# EAGLE schematic ProcessorTestBoardV2 (EAGLE 7.6.0)
Small breakout board to test basic funtionality of processor. Contains programming connectors, I2C IR sensors, 3V3 and 3V6 voltage regulators, a bus switch, and the MRAM.
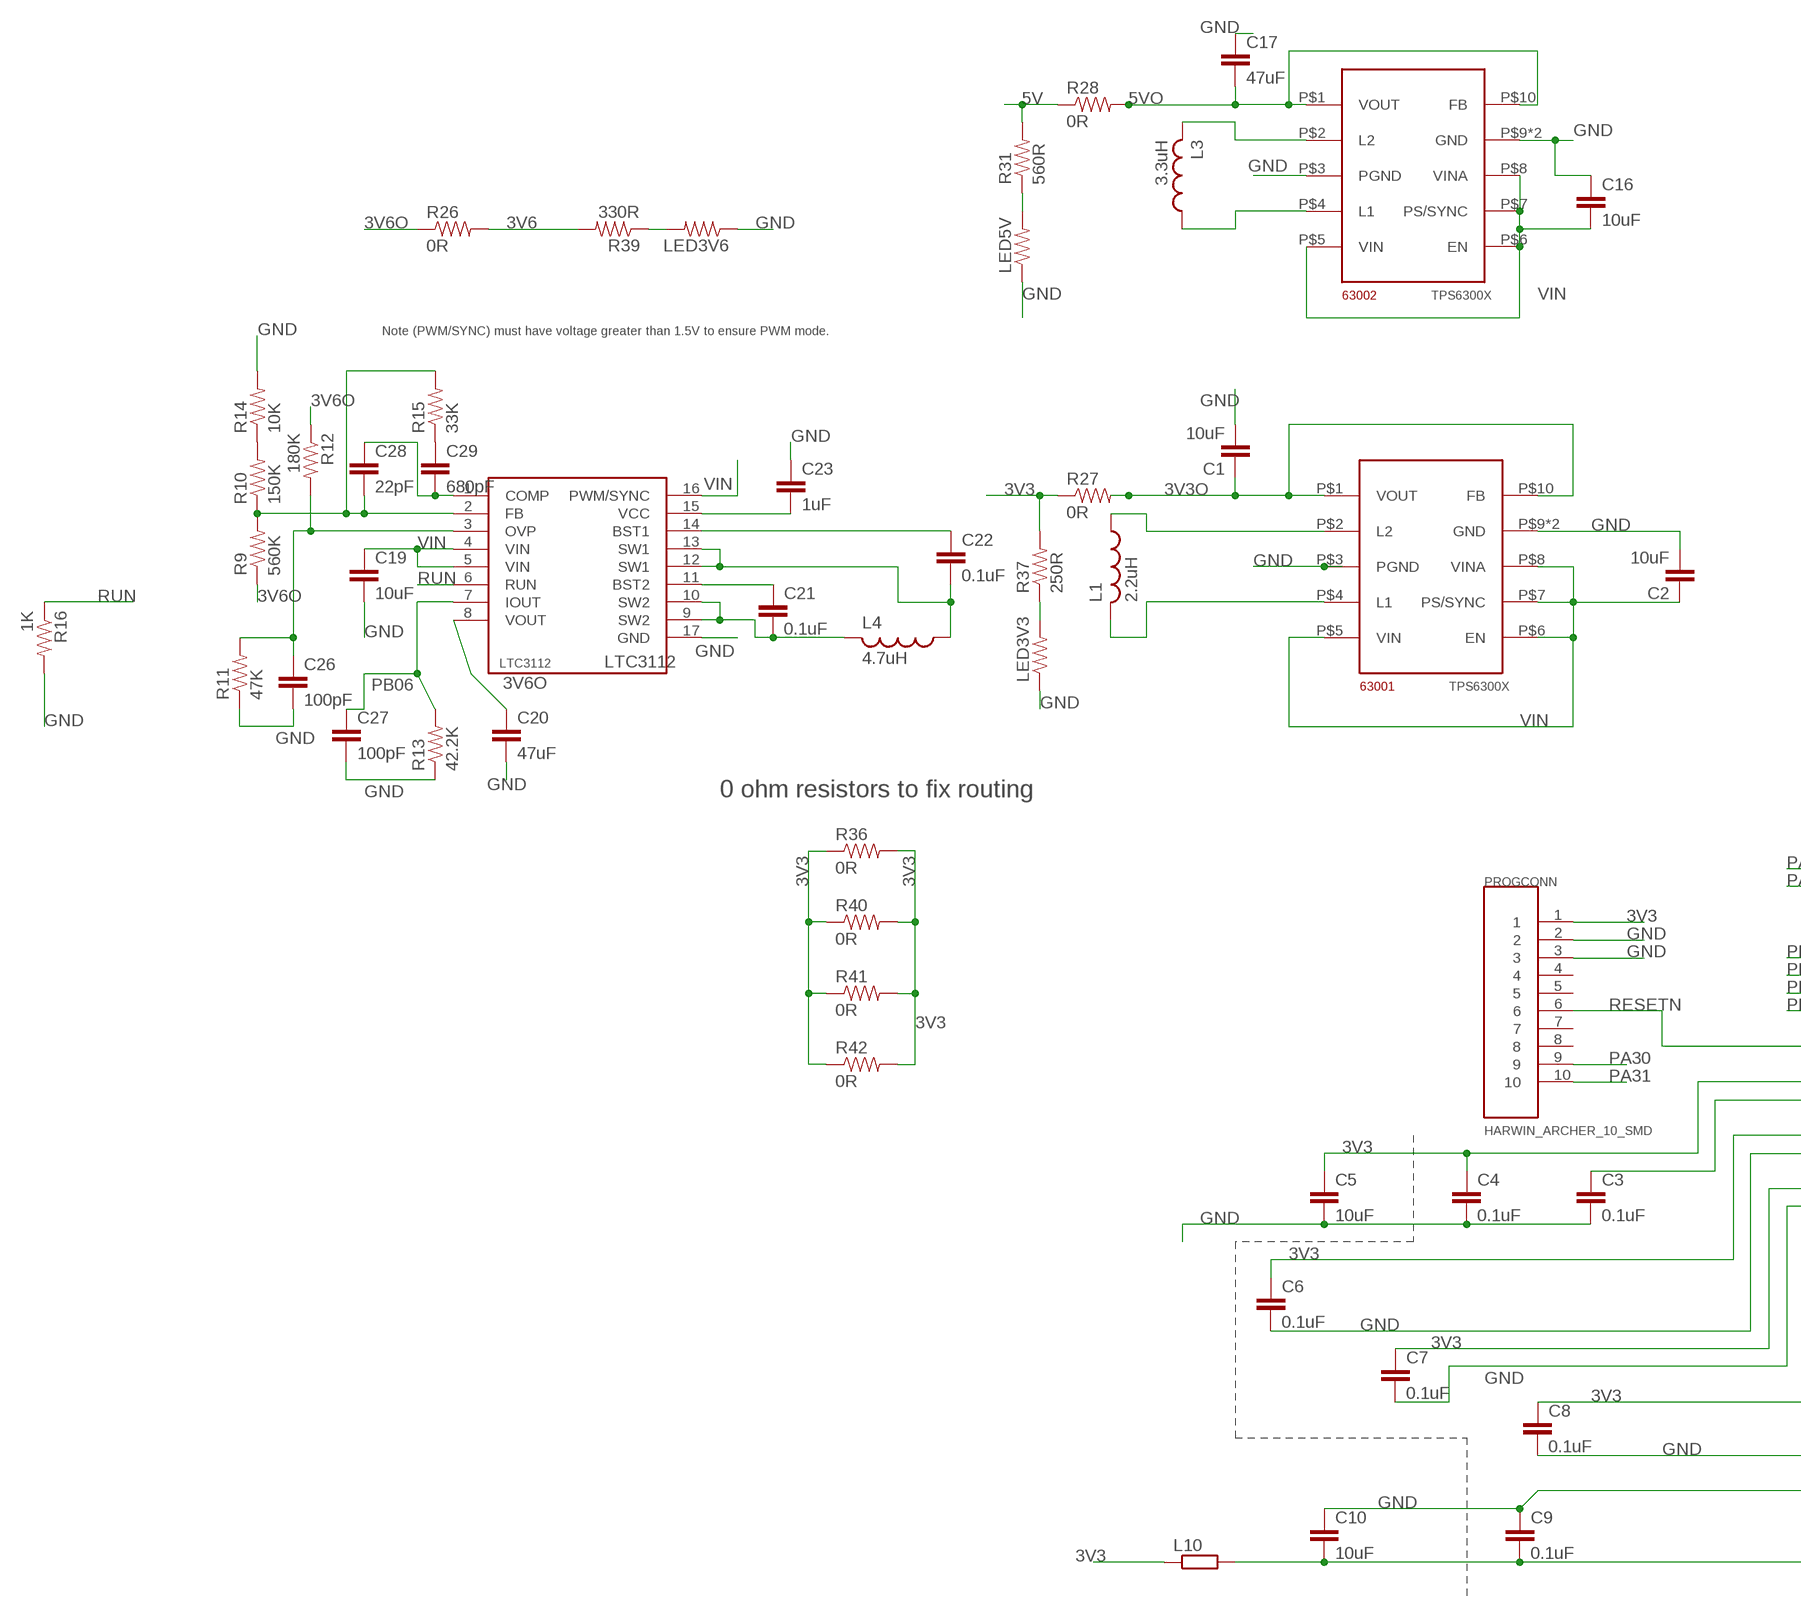
[diagram p0: schematic, sheet 1, part 1 of 2]
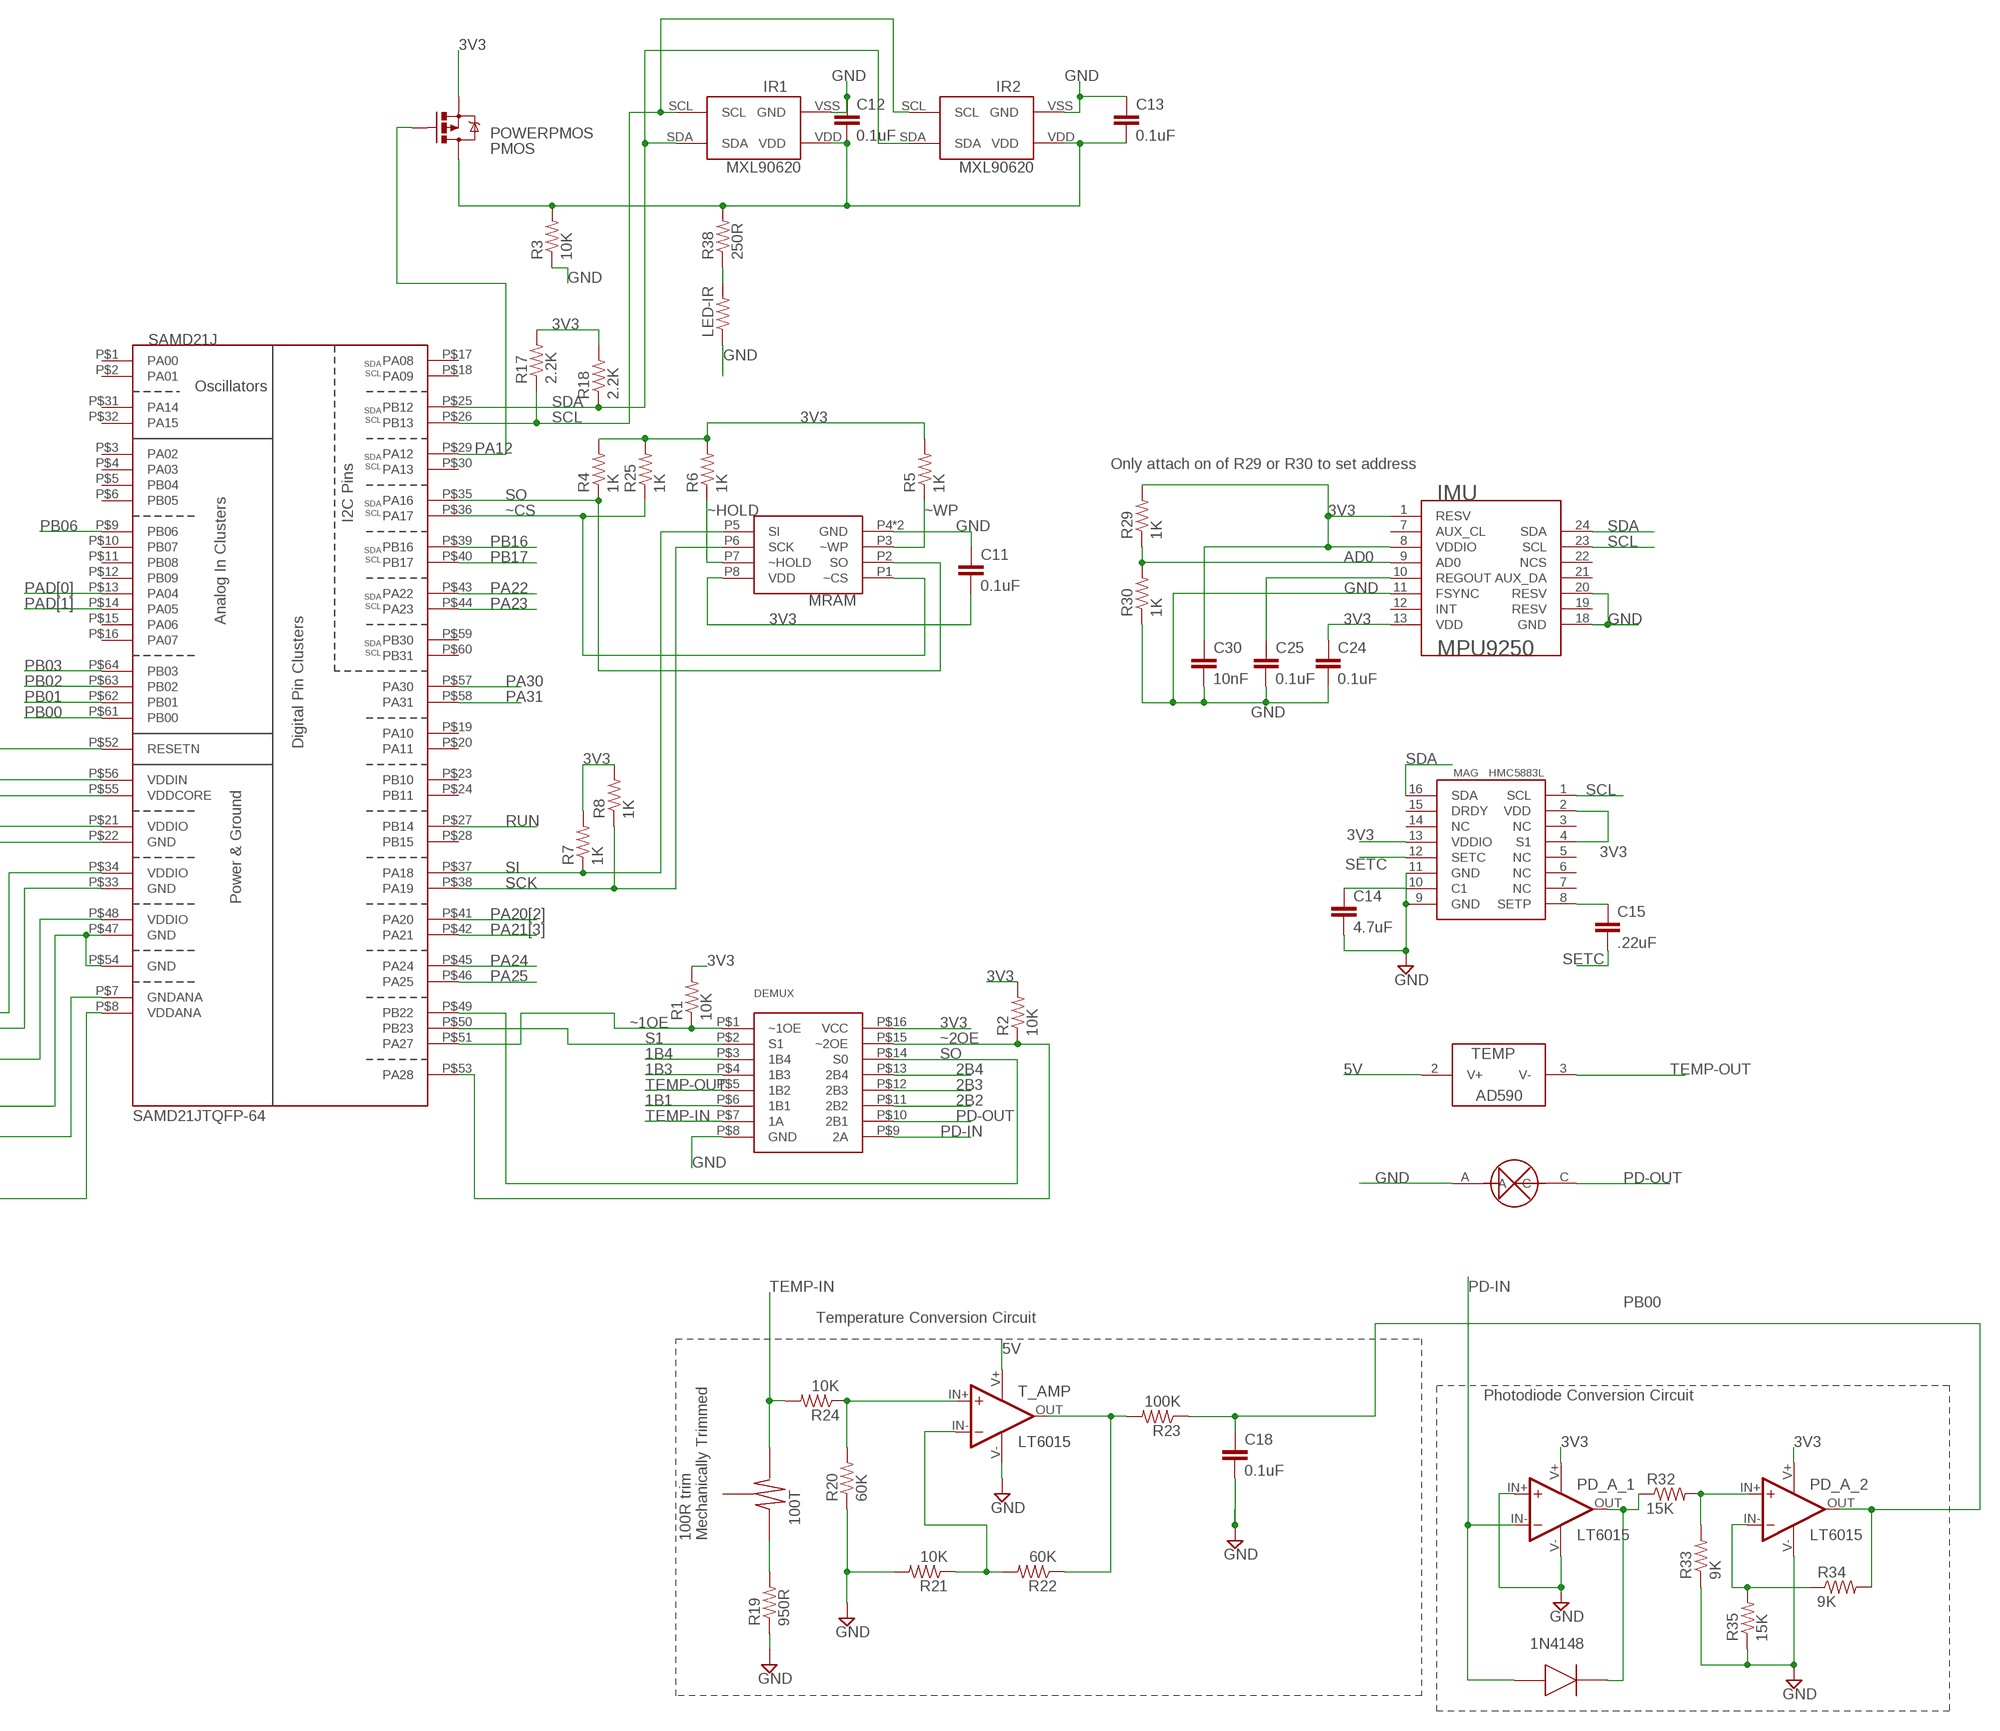
[diagram p1: schematic, sheet 1, part 2 of 2]

## Parts
1N4148  1N4148WS  [SOD-323F]
100T  TRIMPOT-TC33  [TC33X-2]
63001  TPS6300X  [QFN10_POWERPAD]
63002  TPS6300X  [QFN10_POWERPAD]
C1  10uF  CAP0805  [0805]
C2  10uF  CAP0805  [0805]
C3  0.1uF  CAP0805  [0805]
C4  0.1uF  CAP0805  [0805]
C5  10uF  CAP0805  [0805]
C6  0.1uF  CAP0805  [0805]
C7  0.1uF  CAP0805  [0805]
C8  0.1uF  CAP0805  [0805]
C9  0.1uF  CAP0805  [0805]
C10  10uF  CAP0805  [0805]
C11  0.1uF  CAP0805  [0805]
C12  0.1uF  CAP0805  [0805]
C13  0.1uF  CAP0805  [0805]
C14  4.7uF  CAP0805  [0805]
C15  .22uF  CAP0805  [0805]
C16  10uF  CAP0603-CAP  [0603-CAP]
C17  47uF  CAP0603-CAP  [0603-CAP]
C18  0.1uF  CAP0805  [0805]
C19  10uF  CAP0603-CAP  [0603-CAP]
C20  47uF  CAP0805  [0805]
C21  0.1uF  CAP0603-CAP  [0603-CAP]
C22  0.1uF  CAP0603-CAP  [0603-CAP]
C23  1uF  CAP0603-CAP  [0603-CAP]
C24  0.1uF  CAP0805  [0805]
C25  0.1uF  CAP0805  [0805]
C26  100pF  CAP0805  [0805]
C27  100pF  CAP0805  [0805]
C28  22pF  CAP0805  [0805]
C29  680pF  CAP0805  [0805]
C30  10nF  CAP0805  [0805]
DEMUX  SN74CBTLV3253  [SOIC16R]
IMU  MPU9250  [QFN-24-3X3]
IR1  MXL90620  [MXL90620]
IR2  MXL90620  [MXL90620]
L1  2.2uH  L-USL3225M  [L3225M]
L3  3.3uH  L-USL3225M  [L3225M]
L4  4.7uH  L-USL3225M  [L3225M]
L10  R-EU_R0805  [R0805]
LED3V3  RESISTOR  [0805]
LED3V6  RESISTOR  [0805]
LED5V  RESISTOR  [0805]
LED-IR  RESISTOR  [0805]
LTC3112  LTC3112  [DHD16]
MAG  HMC5883L  [HMC5883L]
MRAM  MR25H10CDC  [8PXMO-229]
PD  PHOTODETECTOR  [PHOTODECTORDEVICE2]
PD_A_1  LT6015  [SOT23-5]
PD_A_2  LT6015  [SOT23-5]
PMOS  POWERPMOS  [SO08]
PROGCONN  HARWIN_ARCHER_10_SMD  [HARWIN_ARCHER_10_SMD]
R1  10K  RESISTOR  [0805]
R2  10K  RESISTOR  [0805]
R3  10K  RESISTOR  [0805]
R4  1K  RESISTOR  [0805]
R5  1K  RESISTOR  [0805]
R6  1K  RESISTOR  [0805]
R7  1K  RESISTOR  [0805]
R8  1K  RESISTOR  [0805]
R9  560K  RESISTOR  [0805]
R10  150K  RESISTOR  [0805]
R11  47K  RESISTOR  [0805]
R12  180K  RESISTOR  [0805]
R13  42.2K  RESISTOR  [0805]
R14  10K  RESISTOR  [0805]
R15  33K  RESISTOR  [0805]
R16  1K  RESISTOR  [0805]
R17  2.2K  RESISTOR  [0805]
R18  2.2K  RESISTOR  [0805]
R19  950R  RESISTOR  [0805]
R20  60K  RESISTOR  [0805]
R21  10K  RESISTOR  [0805]
R22  60K  RESISTOR  [0805]
R23  100K  RESISTOR  [0805]
R24  10K  RESISTOR  [0805]
R25  1K  RESISTOR  [0805]
R26  0R  RESISTOR  [0805]
R27  0R  RESISTOR  [0805]
R28  0R  RESISTOR  [0805]
R29  1K  RESISTOR  [0805]
R30  1K  RESISTOR  [0805]
R31  560R  RESISTOR  [0805]
R32  15K  RESISTOR  [0805]
R33  9K  RESISTOR  [0805]
R34  9K  RESISTOR  [0805]
R35  15K  RESISTOR  [0805]
R36  0R  RESISTOR  [0805]
R37  250R  RESISTOR  [0805]
R38  250R  RESISTOR  [0805]
R39  330R  RESISTOR  [0805]
R40  0R  RESISTOR  [0805]
R41  0R  RESISTOR  [0805]
R42  0R  RESISTOR  [0805]
SAMD21J  SAMD21JTQFP-64  [TQFP-64]
T_AMP  LT6015  [SOT23-5]
TEMP  AD590  AD590-SOIC-8  [8SOIC]

## Nets
1B1: DEMUX.P$6(1B1)
1B3: DEMUX.P$4(1B3)
1B4: DEMUX.P$3(1B4)
2B2: DEMUX.P$11(2B2)
2B3: DEMUX.P$12(2B3)
2B4: DEMUX.P$13(2B4)
3V3: C4.1 C5.1 C6.1 C7.1 C8.1 C11.2 C24.1 C30.1 DEMUX.P$16(VCC) IMU.1(RESV) IMU.8(VDDIO) IMU.13(VDD) L10.1 MAG.2(VDD) MAG.4(S1) MAG.13(VDDIO) MRAM.P8(VDD) PD_A_1.V+ PD_A_2.V+ PMOS.1(S) PMOS.2(S) PMOS.3(S) PROGCONN.1 R1.2 R2.2 R4.2 R5.2 R6.2 R7.2 R8.2 R17.2 R18.2 R25.2 R27.1 R29.2 R36.1 R36.2 R37.2 R40.1 R40.2 R41.1 R41.2 R42.1 R42.2 SAMD21J.P$21(VDDIO) SAMD21J.P$34(VDDIO) SAMD21J.P$48(VDDIO) SAMD21J.P$56(VDDIN)
3V3O: 63001.P$1(VOUT) 63001.P$10(FB) C1.1 R27.2
3V6: R26.2 R39.2
3V6O [3V6]: C20.1 LTC3112.8(VOUT) R9.1 R12.1 R26.1
5V [5V]: R28.1 R31.2 T_AMP.V+ TEMP.2(V+)
5VO [5V]: 63002.P$1(VOUT) 63002.P$10(FB) C17.2 R28.2
AD0: IMU.9(AD0) R29.1 R30.2
GND: 63001.P$3(PGND) 63001.P$9(GND) 63001.PAD(GND) 63002.P$3(PGND) 63002.P$9(GND) 63002.PAD(GND) C1.2 C2.2 C3.2 C4.2 C5.2 C6.2 C7.2 C8.2 C9.1 C10.1 C11.1 C12.1 C13.1 C14.2 C16.1 C17.1 C18.2 C19.2 C20.2 C23.1 C24.2 C25.2 C26.2 C27.2 C30.2 DEMUX.P$8(GND) IMU.11(FSYNC) IMU.18(GND) IMU.20(RESV) IR1.VSS(GND) IR2.VSS(GND) LED3V3.1 LED3V6.1 LED5V.1 LED-IR.1 LTC3112.17(GND) MAG.9(GND) MAG.11(GND) MRAM.P4(GND) MRAM.P9(GND) PD.A PD_A_1.IN+ PD_A_1.V- PD_A_2.V- PROGCONN.2 PROGCONN.3 R3.1 R11.1 R13.1 R14.2 R16.2 R19.1 R20.1 R21.2 R30.1 R33.1 R35.1 SAMD21J.P$7(GNDANA) SAMD21J.P$22(GND) SAMD21J.P$33(GND) SAMD21J.P$47(GND) SAMD21J.P$54(GND) T_AMP.V-
N$1: C12.2 C13.2 IR1.VDD IR2.VDD PMOS.5(D) PMOS.6(D) PMOS.7(D) PMOS.8(D) R3.2 R38.2
N$2: 63001.P$4(L1) L1.2
N$3: 63001.P$2(L2) L1.1
N$4: C21.1 LTC3112.11(BST2)
N$5: C22.1 LTC3112.14(BST1)
N$6: C23.2 LTC3112.15(VCC)
N$7: C14.1 MAG.10(C1)
N$8: C3.1 SAMD21J.P$55(VDDCORE)
N$9 [GND]: R20.2 R24.1 T_AMP.IN+
N$10: R22.1 R23.2 T_AMP.OUT
N$11: R21.1 R22.2 T_AMP.IN-
N$12: 1N4148.CATHODE PD_A_1.OUT R32.1
N$13: 100T.P$1 R19.2
N$14: C25.1 IMU.10(REGOUT)
N$15: PD_A_2.IN+ R32.2 R33.2
N$16: LED-IR.2 R38.1
N$17: C9.2 C10.2 L10.2 SAMD21J.P$8(VDDANA)
N$19: PD_A_2.IN- R34.1 R35.2
N$21: LED3V6.2 R39.1
N$22: LED5V.2 R31.1
N$23: LED3V3.2 R37.1
N$36: C15.1 MAG.8(SETP)
N$40: C22.2 L4.1 LTC3112.12(SW1) LTC3112.13(SW1)
N$45: 63002.P$2(L2) L3.2
N$46: 63002.P$4(L1) L3.1
N$53: C21.2 L4.2 LTC3112.9(SW2) LTC3112.10(SW2)
N$54: C28.2 LTC3112.2(FB) R9.2 R10.1 R15.2
N$69: C26.1 LTC3112.3(OVP) R11.2 R12.2
N$70: C29.1 R15.1
N$71: C28.1 C29.2 LTC3112.1(COMP)
N$999: R10.2 R14.1
PA12: PMOS.4(G) SAMD21J.P$29(PA12)
PA20[2]: SAMD21J.P$41(PA20)
PA21[3]: SAMD21J.P$42(PA21)
PA22: SAMD21J.P$43(PA22)
PA23: SAMD21J.P$44(PA23)
PA24: SAMD21J.P$45(PA24)
PA25: SAMD21J.P$46(PA25)
PA30: PROGCONN.9 SAMD21J.P$57(PA30)
PA31: PROGCONN.10 SAMD21J.P$58(PA31)
PAD[0]: SAMD21J.P$13(PA04)
PAD[1]: SAMD21J.P$14(PA05)
PB00: C18.1 PD_A_2.OUT R23.1 R34.2 SAMD21J.P$61(PB00)
PB01: SAMD21J.P$62(PB01)
PB02: SAMD21J.P$63(PB02)
PB03: SAMD21J.P$64(PB03)
PB06: C27.1 LTC3112.7(IOUT) R13.2 SAMD21J.P$9(PB06)
PB16: SAMD21J.P$39(PB16)
PB17: SAMD21J.P$40(PB17)
PD-IN: 1N4148.ANODE DEMUX.P$9(2A) PD_A_1.IN-
PD-OUT: DEMUX.P$10(2B1) PD.C
RESETN: PROGCONN.6 SAMD21J.P$52(RESETN)
RUN: LTC3112.6(RUN) R16.1 SAMD21J.P$27(PB14)
S1: DEMUX.P$2(S1) SAMD21J.P$50(PB23)
SCK: MRAM.P6(SCK) R8.1 SAMD21J.P$38(PA19)
SCL: IMU.23(SCL) IR1.SCL IR2.SCL MAG.1(SCL) R17.1 SAMD21J.P$26(PB13)
SDA: IMU.24(SDA) IR1.SDA IR2.SDA MAG.16(SDA) R18.1 SAMD21J.P$25(PB12)
SETC: C15.2 MAG.12(SETC)
SI: MRAM.P5(SI) R7.1 SAMD21J.P$37(PA18)
SO: DEMUX.P$14(S0) MRAM.P2(SO) R4.1 SAMD21J.P$35(PA16) SAMD21J.P$49(PB22)
TEMP-IN: 100T.P$3 DEMUX.P$7(1A) R24.2
TEMP-OUT: DEMUX.P$5(1B2) TEMP.3(V-)
VIN: 63001.P$5(VIN) 63001.P$6(EN) 63001.P$7(PS/SYNC) 63001.P$8(VINA) 63002.P$5(VIN) 63002.P$6(EN) 63002.P$7(PS/SYNC) 63002.P$8(VINA) C2.1 C16.2 C19.1 LTC3112.4(VIN) LTC3112.5(VIN) LTC3112.16(PWM/SYNC)
~1OE: DEMUX.P$1(~1OE) R1.1 SAMD21J.P$51(PA27)
~2OE: DEMUX.P$15(~2OE) R2.1 SAMD21J.P$53(PA28)
~CS: MRAM.P1(~CS) R25.1 SAMD21J.P$36(PA17)
~HOLD: MRAM.P7(~HOLD) R6.1
~WP: MRAM.P3(~WP) R5.1
Unconnected: 100T.P$2 IMU.7(AUX_CL) IMU.12(INT) IMU.19(RESV) IMU.21(AUX_DA) IMU.22(NCS) MAG.3(NC) MAG.5(NC) MAG.6(NC) MAG.7(NC) MAG.14(NC) MAG.15(DRDY) PROGCONN.4 PROGCONN.5 PROGCONN.7 PROGCONN.8 SAMD21J.P$1(PA00) SAMD21J.P$2(PA01) SAMD21J.P$3(PA02) SAMD21J.P$4(PA03) SAMD21J.P$5(PB04) SAMD21J.P$6(PB05) SAMD21J.P$10(PB07) SAMD21J.P$11(PB08) SAMD21J.P$12(PB09) SAMD21J.P$15(PA06) SAMD21J.P$16(PA07) SAMD21J.P$17(PA08) SAMD21J.P$18(PA09) SAMD21J.P$19(PA10) SAMD21J.P$20(PA11) SAMD21J.P$23(PB10) SAMD21J.P$24(PB11) SAMD21J.P$28(PB15) SAMD21J.P$30(PA13) SAMD21J.P$31(PA14) SAMD21J.P$32(PA15) SAMD21J.P$59(PB30) SAMD21J.P$60(PB31)

## Notes on the sheet
- Note (PWM/SYNC) must have voltage greater than 1.5V to ensure PWM mode.
- Only attach on of R29 or R30 to set address
- 0 ohm resistors to fix routing
- Temperature Conversion Circuit
- Photodiode Conversion Circuit
- 100R trim
  Mechanically Trimmed

## Library data of the parts
1N4148 = CNTRL_BOARD:1N4148WS
100T = CNTRL_BOARD:TRIMPOT-TC33
63001 = CNTRL_BOARD:TPS6300X
63002 = CNTRL_BOARD:TPS6300X; OC_NEWARK: unknown
C1-C13 C18 C24 C25 C30 = CNTRL_BOARD:CAP: Capacitor Standard 0603 ceramic capacitor, and 0.1" leaded capacitor.
C14 = CNTRL_BOARD:CAP: Capacitor Standard 0603 ceramic capacitor, and 0.1" leaded capacitor.; MF: AVX CORPORATION; MPN: 08056D475KAT2A; OC_NEWARK: 84K8400
C15 = CNTRL_BOARD:CAP: Capacitor Standard 0603 ceramic capacitor, and 0.1" leaded capacitor.; MF: AVX CORPORATION; MPN: 08053C224KAT2A; OC_NEWARK: 96K4775
C16 = CNTRL_BOARD:CAP: Capacitor Standard 0603 ceramic capacitor, and 0.1" leaded capacitor.; MPN: C1608X5R1A225K080AC; OC_NEWARK: 04X3244
C17 C20 = CNTRL_BOARD:CAP: Capacitor Standard 0603 ceramic capacitor, and 0.1" leaded capacitor.; MPN: EMK107B7474KA-T; OC_NEWARK: 77M8434
C19 C23 = CNTRL_BOARD:CAP: Capacitor Standard 0603 ceramic capacitor, and 0.1" leaded capacitor.; OC_NEWARK: unknown
C21 C22 = CNTRL_BOARD:CAP: Capacitor Standard 0603 ceramic capacitor, and 0.1" leaded capacitor.; MPN: 0603YC104JAT2A; OC_NEWARK: 96M1175
C26 C27 = CNTRL_BOARD:CAP: Capacitor Standard 0603 ceramic capacitor, and 0.1" leaded capacitor.; MF: AVX CORPORATION; MPN: 08051A101J4T4A; OC_NEWARK: 55J5675
C28 = CNTRL_BOARD:CAP: Capacitor Standard 0603 ceramic capacitor, and 0.1" leaded capacitor.; MF: AVX CORPORATION; MPN: 08051A220JAT2A; OC_NEWARK: 96K4769
C29 = CNTRL_BOARD:CAP: Capacitor Standard 0603 ceramic capacitor, and 0.1" leaded capacitor.; MPN: 08055C681KAT2A; OC_NEWARK: 94W2947
DEMUX = CNTRL_BOARD:SN74CBTLV3253
IMU = CNTRL_BOARD:MPU9250
IR1 IR2 = CNTRL_BOARD:MXL90620
L1 = resistor:L-US: INDUCTOR, American symbol
L3 = resistor:L-US: INDUCTOR, American symbol; MPN: JMK212BJ335KG-T; OC_NEWARK: 08P5148
L4 = resistor:L-US: INDUCTOR, American symbol; OC_NEWARK: unknown
L10 = rcl:R-EU_: RESISTOR, European symbol
LED3V3 LED3V6 LED5V LED-IR R1-R8 R16 R19-R42 = CNTRL_BOARD:RESISTOR
LTC3112 = CNTRL_BOARD:LTC3112; MPN: LTC3112EFE#PBF; OC_NEWARK: 24T2752
MAG = CNTRL_BOARD:HMC5883L; MPN: HMC5883L-TR; OC_NEWARK: 20T0699
MRAM = mram:MR25H10CDC
PD = Solar Panel Parts:PHOTODETECTOR
PD_A_1 PD_A_2 T_AMP = CNTRL_BOARD:LT6015
PMOS = CNTRL_BOARD:POWERPMOS
PROGCONN = CNTRL_BOARD:HARWIN_ARCHER_10_SMD
R9 = CNTRL_BOARD:RESISTOR; MPN: MC01W08051560K; OC_NEWARK: 94W6326
R10 R11 R13-R15 = CNTRL_BOARD:RESISTOR; OC_NEWARK: unknown
R12 = CNTRL_BOARD:RESISTOR; MPN: ERJ-6GEYJ184V; OC_NEWARK: 53W4944
R17 R18 = CNTRL_BOARD:RESISTOR; MPN: SR1-0805-222; OC_NEWARK: 33C6600
SAMD21J = SAMD21J_Easy:SAMD21J
TEMP = CNTRL_BOARD:AD590-SOIC-8

## Net classes
1 GND: width 0.508 mm, drill 0.254 mm, clearance 0.305 mm
2 3V3: width 0.508 mm, drill 0.254 mm, clearance 0.305 mm
3 3V6: width 1.016 mm, drill 0.254 mm, clearance 0.305 mm
4 5V: width 0.508 mm, drill 0.254 mm, clearance 0.305 mm